# Altium schematic sheet TAPLFO.SchDoc
size A
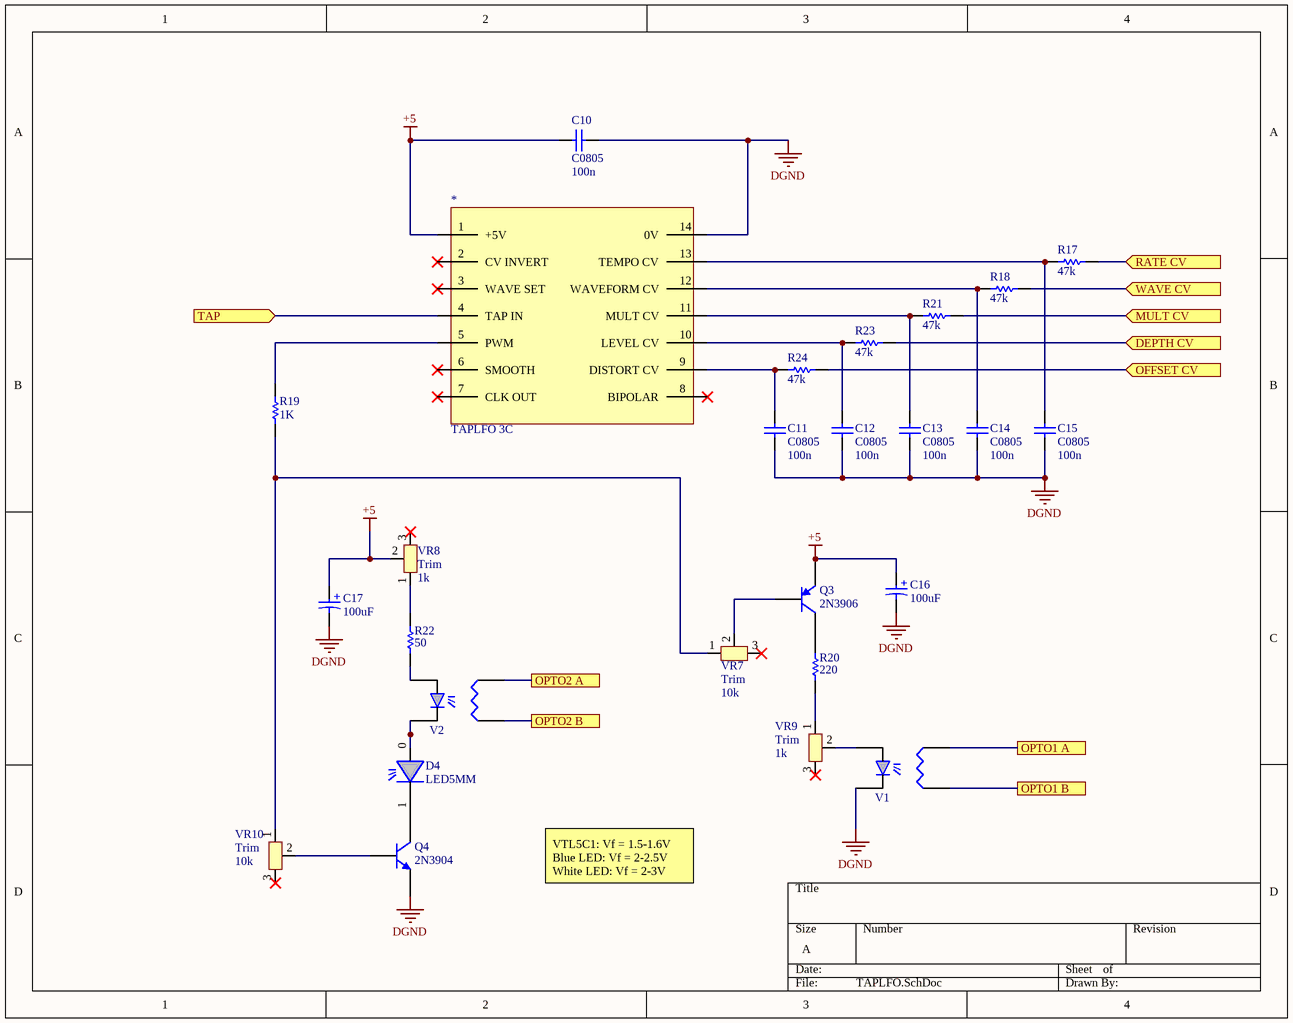
[diagram p0: TAPLFO.SchDoc]

## Parts
*  TAPLFO 3C  [DIP-14]
C10  C0805  value 100n  [0805]
C11  C0805  value 100n  [0805]
C12  C0805  value 100n  [0805]
C13  C0805  value 100n  [0805]
C14  C0805  value 100n  [0805]
C15  C0805  value 100n  [0805]
C16  value 100uF  [100uF CAP 2.5mm]  (hidden comment: CAP ELEC 100uF)
C17  value 100uF  [100uF CAP 2.5mm]  (hidden comment: CAP ELEC 100uF)
D4  LED5MM  [LED5MM]
Q3  2N3906  [TO-92A]
Q4  2N3904  [TO-92A]
R17  47k  [ERA-0805]
R18  47k  [ERA-0805]
R19  value 1K  [AXIAL-0.3]  (hidden comment: Res1)
R20  value 220  [AXIAL-0.3]  (hidden comment: Res1)
R21  47k  [ERA-0805]
R22  value 50  [AXIAL-0.3]  (hidden comment: Res1)
R23  47k  [ERA-0805]
R24  47k  [ERA-0805]
V1  Vactrol  [VACTROL]  (value not drawn)
V2  Vactrol  [VACTROL]  (value not drawn)
VR7  Trim  value 10k  [Trimpot - Bourns]
VR8  Trim  value 1k  [Trimpot - Bourns]
VR9  Trim  value 1k  [Trimpot - Bourns]
VR10  Trim  value 10k  [Trimpot - Bourns]

## Ports
DEPTH CV (in), MULT CV (in), OFFSET CV (in), OPTO1 A, OPTO1 B, OPTO2 A, OPTO2 B, RATE CV (in), TAP (in), WAVE CV (in)

## Nets
+5: *.1(+5V) C10.2 C16.1 C17.1 Q3.1(E) VR8.2
DGND: *.14(0V) C10.1 C11.1 C12.1 C13.1 C14.1 C15.1 C16.2 C17.2 Q4.1(E) V1.1
DEPTH CV: R23.2 ; port DEPTH CV
MULT CV: R21.2 ; port MULT CV
OFFSET CV: R24.2 ; port OFFSET CV
OPTO1 A: V1.3 ; port OPTO1 A
OPTO1 B: V1.2 ; port OPTO1 B
OPTO2 A: V2.3 ; port OPTO2 A
OPTO2 B: V2.2 ; port OPTO2 B
RATE CV: R17.2 ; port RATE CV
TAP: *.4(TAP_IN) ; port TAP
WAVE CV: R18.2 ; port WAVE CV
Net*_5: *.5(PWM) R19.1
Net*_9: *.9(DISTORT_CV) C11.2 R24.1
Net*_10: *.10(LEVEL_CV) C12.2 R23.1
Net*_11: *.11(MULT_CV) C13.2 R21.1
Net*_12: *.12(WAVEFORM_CV) C14.2 R18.1
Net*_13: *.13(TEMPO_CV) C15.2 R17.1
NetD4_0: D4.0 V2.1
NetD4_1: D4.1 Q4.3(C)
NetQ3_2: Q3.2(B) VR7.2
NetQ3_3: Q3.3(C) R20.2
NetQ4_2: Q4.2(B) VR10.2
NetR19_2: R19.2 VR7.1 VR10.1
NetR20_1: R20.1 VR9.1
NetR22_1: R22.1 V2.0
NetR22_2: R22.2 VR8.1
NetV1_0: V1.0 VR9.2

Not connected (* = marked no-connect by the designer): * 2(CV_INVERT)* 3(WAVE_SET)* 6(SMOOTH)* 7(CLK_OUT)* 8(BIPOLAR)*; VR7 3*; VR8 3*; VR9 3*; VR10 3*

## Notes on the sheet
- VTL5C1: Vf = 1.5-1.6V
  Blue LED: Vf = 2-2.5V
  White LED: Vf = 2-3V
- (in symbol CAP ELEC 100uF) +

## Library data of the parts
C10-C15 = C0805: Ceramic Chip Capacitor - Standard; Note: Footprint corresponds to dimensions for bulk cassette packaging. This case size has tightened tolerances.; Published: 17-Jul-2002; LatestRevisionDate: 19-Mar-2004; LatestRevisionNote: Silkscreen size reduced.; DatasheetDocument: Mar-2001; PackageDocument: Mar-2001; PackageReference: 0805; Publisher: Altium Limited; Code_JEITA: 0805; Code_IPC: 2012[0805]; ComponentLink1Description: Manufacturer Link; ComponentLink1URL: http://www.kemet.com/; ComponentLink2Description: Datasheet; ComponentLink2URL: http://www.kemet.com/kemet/web/homepage/kechome.nsf/vapubfilesname/F3102TA.pdf/$file/F3102TA.pdf
C16 C17 = CAP ELEC 100uF: MPN: UFW1E101MED1TD; Manufacturer: Nichicon; Voltage Rating: 25V; Height: 11mm
Q3 = 2N3906: PNP General Purpose Amplifier; Published: 8-Jun-2000; LatestRevisionDate: 15-Jan-2003; LatestRevisionNote: PCB Footprint 'BCY-W3/D4.7' replaced; DatasheetVersion: 1997; PackageVersion: Sep-1998; PackageReference: TO-92A; Publisher: Altium Limited; PackageDescription: TO, Flat Index; 3 In-Line, Axial Leads; Body Dia. 4.5mm; Leads 0.51 x 0.48 mm (max); ComponentLink1Description: Manufacturer Link; ComponentLink1URL: http://www.fairchildsemi.com/; ComponentLink2Description: Datasheet; ComponentLink2URL: http://www.fairchildsemi.com/ds/2N%2F2N3906.pdf
Q4 = 2N3904: NPN General Purpose Amplifier; Published: 8-Jun-2000; LatestRevisionDate: 15-Jan-2003; LatestRevisionNote: PCB Footprint 'BCY-W3/D4.7' replaced; DatasheetVersion: 1997; PackageVersion: Sep-1998; PackageReference: TO-92A; Publisher: Altium Limited; PackageDescription: TO, Flat Index; 3 In-Line, Axial Leads; Body Dia. 4.5mm; Leads 0.51 x 0.48 mm (max); ComponentLink1Description: Manufacturer Link; ComponentLink1URL: http://www.fairchildsemi.com/; ComponentLink2Description: Datasheet; ComponentLink2URL: http://www.fairchildsemi.com/ds/2N%2F2N3904.pdf
R17 R18 R21 R23 R24 = ERAS: Resistor 0805; Note: If flow soldering, adjust pad width of PCB Footprint to 0.7 - 0.8 times the width of the resistor.; Published: 17-Dec-2003; LatestRevisionDate: 19-Mar-2004; LatestRevisionNote: Silkscreen size reduced.; PackageDocument: Mar-2003; PackageReference: ERA-0805; Publisher: Altium Limited; Code_IPC: 2012 [0805]; ComponentLink1Description: Manufacturer Link; ComponentLink1URL: http://www.panasonic.com/industrial/components/resistive_products.htm; ComponentLink2Description: Datasheet; ComponentLink2URL: http://www.panasonic.com/industrial/components/pdf/AOF0000CE1.pdf
R19 R20 R22 = Res1: Resistor; Published: 8-Jun-2000; LatestRevisionDate: 17-Jul-2002; LatestRevisionNote: Re-released for DXP Platform.; PackageReference: AXIAL-0.3; Publisher: Altium Limited; PackageDescription: Axial Device, Thru-Hole; 2 Leads; 0.3 in Pin Spacing
VR7-VR10 = Trimpot - Bourns